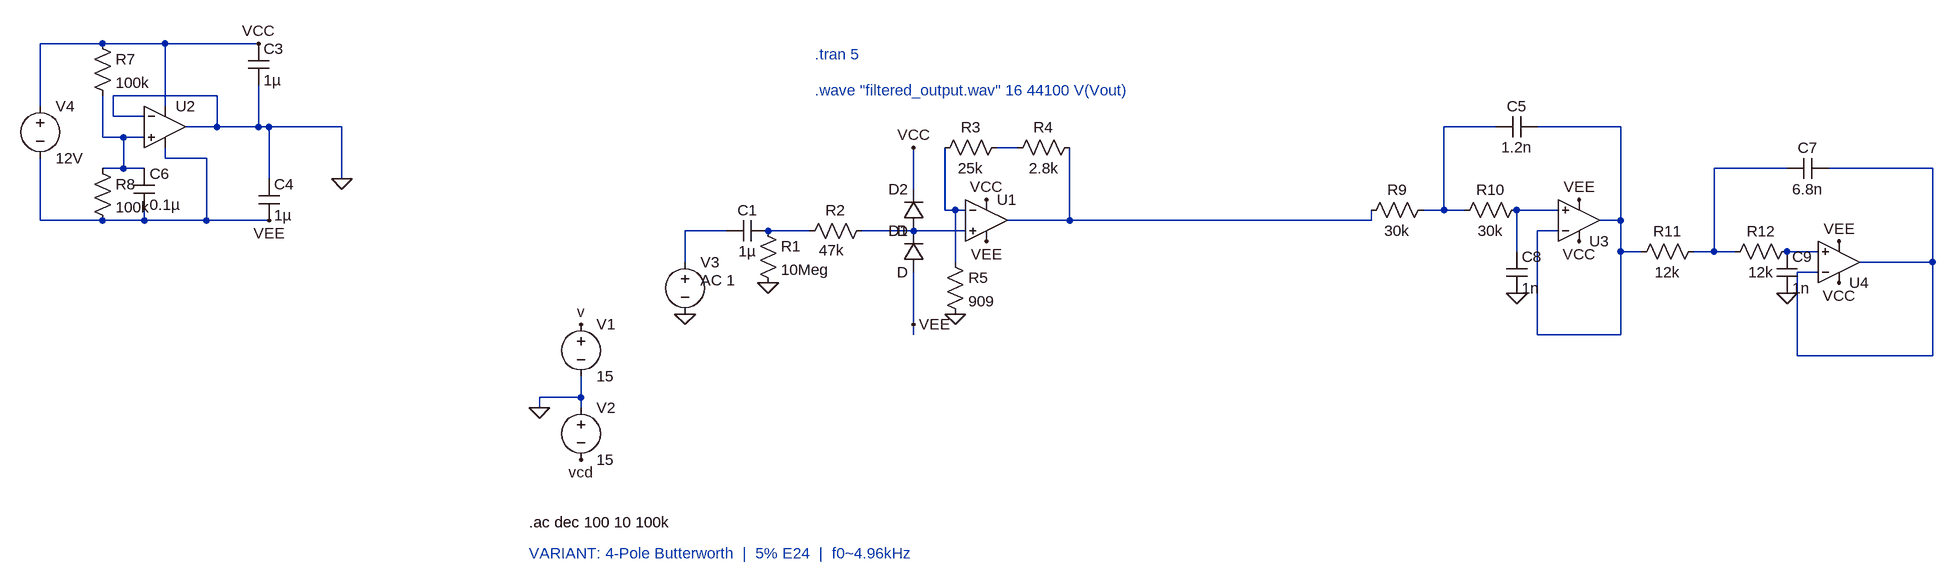
[diagram p0: schematic EqualC_Butterworth_E24_5pct.asc]
EqualC_Butterworth_E24_5pct.asc, the LTspice schematic file:
Version 4.1
SHEET 1 2084 680
WIRE -752 -352 -848 -352
WIRE -656 -352 -752 -352
WIRE -512 -352 -656 -352
WIRE -576 -272 -736 -272
WIRE -848 -256 -848 -352
WIRE -656 -256 -656 -352
WIRE -736 -240 -736 -272
WIRE -688 -240 -736 -240
WIRE -576 -224 -576 -272
WIRE -576 -224 -624 -224
WIRE -512 -224 -512 -288
WIRE -512 -224 -576 -224
WIRE -496 -224 -512 -224
WIRE -384 -224 -496 -224
WIRE 1392 -224 1312 -224
WIRE 1584 -224 1456 -224
WIRE -752 -208 -752 -272
WIRE -720 -208 -752 -208
WIRE -688 -208 -720 -208
WIRE 656 -192 624 -192
WIRE -656 -176 -656 -192
WIRE -592 -176 -656 -176
WIRE -720 -160 -720 -208
WIRE -720 -160 -752 -160
WIRE -688 -160 -720 -160
WIRE 1840 -160 1728 -160
WIRE 2064 -160 1904 -160
WIRE -496 -144 -496 -224
WIRE -384 -144 -384 -224
WIRE 496 -128 496 -192
WIRE 544 -96 544 -192
WIRE 560 -96 544 -96
WIRE 576 -96 560 -96
WIRE 1312 -96 1312 -224
WIRE 1312 -96 1280 -96
WIRE 1344 -96 1312 -96
WIRE 1488 -96 1424 -96
WIRE -848 -80 -848 -176
WIRE -752 -80 -848 -80
WIRE -688 -80 -688 -96
WIRE -688 -80 -752 -80
WIRE -592 -80 -592 -176
WIRE -592 -80 -688 -80
WIRE -496 -80 -592 -80
WIRE 736 -80 736 -192
WIRE 736 -80 640 -80
WIRE 1200 -80 1200 -96
WIRE 1200 -80 736 -80
WIRE 1584 -80 1584 -224
WIRE 1584 -80 1552 -80
WIRE 208 -64 144 -64
WIRE 336 -64 272 -64
WIRE 496 -64 416 -64
WIRE 576 -64 496 -64
WIRE 1488 -64 1456 -64
WIRE 1424 -32 1424 -96
WIRE 1584 -32 1584 -80
WIRE 1616 -32 1584 -32
WIRE 1728 -32 1728 -160
WIRE 1728 -32 1696 -32
WIRE 1760 -32 1728 -32
WIRE 1888 -32 1840 -32
WIRE 144 -16 144 -64
WIRE 560 -16 560 -96
WIRE 2064 -16 2064 -160
WIRE 2064 -16 1952 -16
WIRE 1888 0 1856 0
WIRE 496 80 496 0
WIRE 496 96 496 80
WIRE 1456 96 1456 -64
WIRE 1584 96 1584 -32
WIRE 1584 96 1456 96
WIRE 1856 128 1856 0
WIRE 2064 128 2064 -16
WIRE 2064 128 1856 128
WIRE -16 192 -16 160
WIRE -16 192 -80 192
WIRE -80 208 -80 192
WIRE -16 208 -16 192
FLAG -80 208 0
FLAG -16 80 v
FLAG -16 288 vcd
FLAG 272 16 0
FLAG 608 -112 VCC
FLAG 608 -48 VEE
FLAG 496 -192 VCC
FLAG 496 80 VEE
FLAG 560 64 0
FLAG 144 64 0
FLAG -384 -144 0
FLAG -512 -352 VCC
FLAG -496 -80 VEE
FLAG 1424 32 0
FLAG 1840 32 0
FLAG 1520 -48 VCC
FLAG 1920 16 VCC
FLAG 1520 -112 VEE
FLAG 1920 -48 VEE
SYMBOL voltage -16 64 R0
WINDOW 123 0 0 Left 0
WINDOW 39 0 0 Left 0
SYMATTR InstName V1
SYMATTR Value 15
SYMBOL voltage -16 192 R0
WINDOW 123 0 0 Left 0
WINDOW 39 0 0 Left 0
SYMATTR InstName V2
SYMATTR Value 15
SYMBOL OpAmps\\UniversalOpAmp2 608 -80 R0
SYMATTR InstName U1
SYMBOL voltage 144 -32 R0
WINDOW 3 24 44 Left 2
WINDOW 123 24 44 Left 2
WINDOW 39 0 0 Left 0
SYMATTR Value ""
SYMATTR Value2 AC 1
SYMATTR InstName V3
SYMBOL cap 272 -80 R90
WINDOW 0 0 32 VBottom 2
WINDOW 3 32 32 VTop 2
SYMATTR InstName C1
SYMATTR Value 1µ
SYMBOL res 256 -80 R0
SYMATTR InstName R1
SYMATTR Value 10Meg
SYMBOL res 432 -80 R90
WINDOW 0 0 56 VBottom 2
WINDOW 3 30 62 VTop 2
SYMATTR InstName R2
SYMATTR Value 47k
SYMBOL diode 512 0 R180
WINDOW 0 24 64 Left 2
WINDOW 3 24 0 Left 2
SYMATTR InstName D1
SYMBOL diode 512 -64 R180
WINDOW 0 24 64 Left 2
WINDOW 3 24 0 Left 2
SYMATTR InstName D2
SYMBOL res 640 -208 R90
WINDOW 0 0 56 VBottom 2
WINDOW 3 32 56 VTop 2
SYMATTR InstName R3
SYMATTR Value 25k
SYMBOL res 752 -208 R90
WINDOW 0 0 56 VBottom 2
WINDOW 3 32 56 VTop 2
SYMATTR InstName R4
SYMATTR Value 2.8k
SYMBOL res 544 -32 R0
SYMATTR InstName R5
SYMATTR Value 909
SYMBOL voltage -848 -272 R0
WINDOW 123 0 0 Left 0
WINDOW 39 0 0 Left 0
SYMATTR InstName V4
SYMATTR Value 12V
SYMBOL cap -528 -352 R0
SYMATTR InstName C3
SYMATTR Value 1µ
SYMBOL cap -512 -144 R0
SYMATTR InstName C4
SYMATTR Value 1µ
SYMBOL res -768 -368 R0
SYMATTR InstName R7
SYMATTR Value 100k
SYMBOL res -768 -176 R0
SYMATTR InstName R8
SYMATTR Value 100k
SYMBOL cap -704 -160 R0
SYMATTR InstName C6
SYMATTR Value 0.1µ
SYMBOL OpAmps\\UniversalOpAmp2 -656 -224 R0
SYMATTR InstName U2
SYMBOL res 1296 -112 R90
WINDOW 0 0 56 VBottom 2
WINDOW 3 32 56 VTop 2
SYMATTR InstName R9
SYMATTR Value 30k
SYMBOL res 1440 -112 R90
WINDOW 0 0 56 VBottom 2
WINDOW 3 32 56 VTop 2
SYMATTR InstName R10
SYMATTR Value 30k
SYMBOL res 1712 -48 R90
WINDOW 0 0 56 VBottom 2
WINDOW 3 32 56 VTop 2
SYMATTR InstName R11
SYMATTR Value 12k
SYMBOL res 1856 -48 R90
WINDOW 0 0 56 VBottom 2
WINDOW 3 32 56 VTop 2
SYMATTR InstName R12
SYMATTR Value 12k
SYMBOL cap 1456 -240 R90
WINDOW 0 0 32 VBottom 2
WINDOW 3 32 32 VTop 2
SYMATTR InstName C5
SYMATTR Value 1.2n
SYMBOL cap 1904 -176 R90
WINDOW 0 0 32 VBottom 2
WINDOW 3 32 32 VTop 2
SYMATTR InstName C7
SYMATTR Value 6.8n
SYMBOL OpAmps\\UniversalOpAmp2 1520 -80 M180
SYMATTR InstName U3
SYMATTR Value2 Avol=1Meg GBW=3Meg Slew=10Meg
SYMBOL OpAmps\\UniversalOpAmp2 1920 -16 M180
SYMATTR InstName U4
SYMATTR Value2 Avol=1Meg GBW=3Meg Slew=10Meg
SYMBOL cap 1408 -32 R0
SYMATTR InstName C8
SYMATTR Value 1n
SYMBOL cap 1824 -32 R0
SYMATTR InstName C9
SYMATTR Value 1n
TEXT -96 384 Left 2 !.ac dec 100 10 100k
TEXT 344 -336 Left 2 ;.tran 5
TEXT 344 -280 Left 2 ;.wave "filtered_output.wav" 16 44100 V(Vout)
TEXT -96 432 Left 2 ;VARIANT: 4-Pole Butterworth  |  5% E24  |  f0~4.96kHz

The netlist it stands for:
* EqualC_Butterworth_E24_5pct.asc
V1 v 0 15
V2 0 vcd 15
X§U1 N012 N007 VCC VEE N009 level2 Avol=1Meg GBW=10Meg Slew=10Meg Ilimit=25m Rail=0 Vos=0 En=0 Enk=0 In=0 Ink=0 Rin=500Meg  ; pins In+ In- V+ V- OUT
V3 N010 0 AC 1
C1 N011 N010 1µ
R1 N011 0 10Meg
R2 N012 N011 47k
D1 VEE N012 D
D2 N012 VCC D
R3 N004 N007 25k
R4 N009 N004 2.8k
R5 N007 0 909
V4 VCC VEE 12V
C3 VCC 0 1µ
C4 0 VEE 1µ
R7 VCC N003 100k
R8 N003 VEE 100k
C6 N003 VEE 0.1µ
X§U2 N003 0 VCC VEE 0 level2 Avol=1Meg GBW=10Meg Slew=10Meg Ilimit=25m Rail=0 Vos=0 En=0 Enk=0 In=0 Ink=0 Rin=500Meg  ; pins In+ In- V+ V- OUT
R9 N001 N009 30k
R10 N008 N001 30k
R11 N005 N002 12k
R12 N013 N005 12k
C5 N002 N001 1.2n
C7 N006 N005 6.8n
X§U3 N008 N002 VCC VEE N002 level2 Avol=1Meg GBW=3Meg Slew=10Meg Ilimit=25m Rail=0 Vos=0 En=0 Enk=0 In=0 Ink=0 Rin=500Meg  ; pins In+ In- V+ V- OUT
X§U4 N013 N006 VCC VEE N006 level2 Avol=1Meg GBW=3Meg Slew=10Meg Ilimit=25m Rail=0 Vos=0 En=0 Enk=0 In=0 Ink=0 Rin=500Meg  ; pins In+ In- V+ V- OUT
C8 N008 0 1n
C9 N013 0 1n
.model D D
.lib standard.dio
.ac dec 100 10 100k
* .tran 5
* .wave "filtered_output.wav" 16 44100 V(Vout)
* VARIANT: 4-Pole Butterworth  |  5% E24  |  f0~4.96kHz
.lib UniversalOpAmp2.lib
.backanno
.end